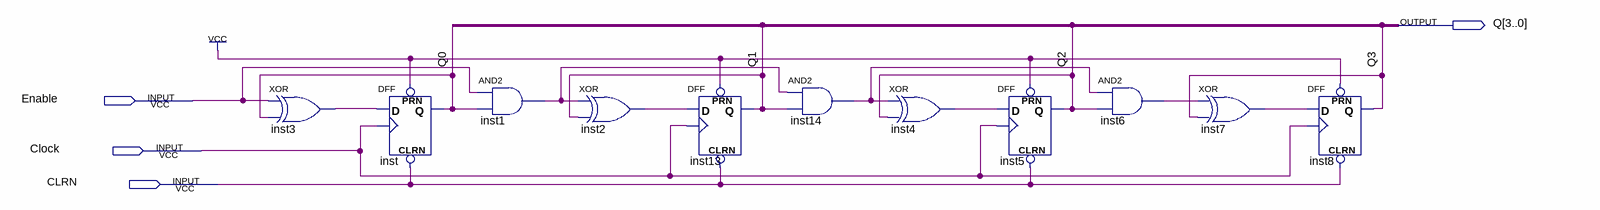
[diagram p0: schematic sheet]
// Quartus schematic lab10step2a.bdf as structural Verilog: 11 symbols, 4 pins
module lab10step2a (
  input  Enable,
  input  Clock,
  input  CLRN,
  output [3:0] Q
);

  wire inst1_out, inst2_out, inst3_out, inst4_out, inst6_out, inst7_out, inst14_out;

  xor inst3 (inst3_out, Enable, Q[0]);
  DFF inst (.CLRN(CLRN), .CLK(Clock), .D(inst3_out), .PRN(1'b1), .Q(Q[0]));
  and inst1 (inst1_out, Enable, Q[0]);
  xor inst2 (inst2_out, inst1_out, Q[1]);
  DFF inst13 (.CLRN(CLRN), .CLK(Clock), .D(inst2_out), .PRN(1'b1), .Q(Q[1]));
  and inst14 (inst14_out, inst1_out, Q[1]);
  xor inst4 (inst4_out, inst14_out, Q[2]);
  DFF inst5 (.CLRN(CLRN), .CLK(Clock), .D(inst4_out), .PRN(1'b1), .Q(Q[2]));
  and inst6 (inst6_out, inst14_out, Q[2]);
  xor inst7 (inst7_out, inst6_out, Q[3]);
  DFF inst8 (.CLRN(CLRN), .CLK(Clock), .D(inst7_out), .PRN(1'b1), .Q(Q[3]));
endmodule
